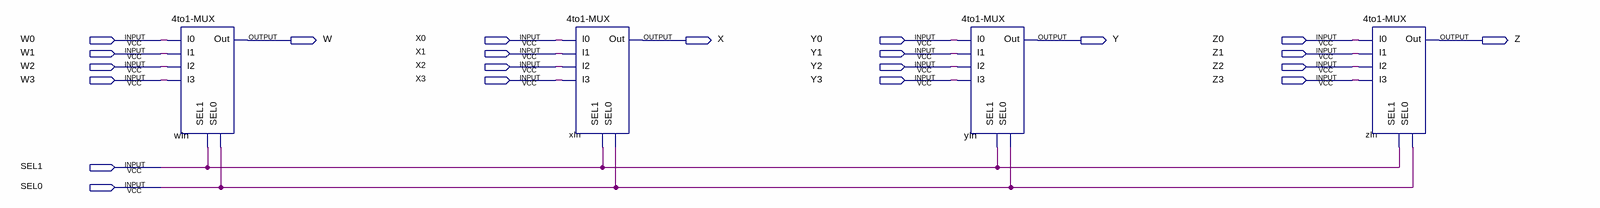
[diagram p0: schematic sheet]
// Quartus schematic QUAD4-1MUX.bdf as structural Verilog: 4 symbols, 22 pins
module \QUAD4-1MUX  (
  input  W0,
  input  X0,
  input  Y0,
  input  Z0,
  input  W1,
  input  X1,
  input  Y1,
  input  Z1,
  input  W2,
  input  X2,
  input  Y2,
  input  Z2,
  input  W3,
  input  X3,
  input  Y3,
  input  Z3,
  input  SEL1,
  input  SEL0,
  output W,
  output X,
  output Y,
  output Z
);

  \4to1-MUX  wIn (.SEL1(SEL1), .SEL0(SEL0), .I0(W0), .I1(W1), .I2(W2), .I3(W3), .Out(W));
  \4to1-MUX  xIn (.SEL1(SEL1), .SEL0(SEL0), .I0(X0), .I1(X1), .I2(X2), .I3(X3), .Out(X));
  \4to1-MUX  yIn (.SEL1(SEL1), .SEL0(SEL0), .I0(Y0), .I1(Y1), .I2(Y2), .I3(Y3), .Out(Y));
  \4to1-MUX  zIn (.SEL1(SEL1), .SEL0(SEL0), .I0(Z0), .I1(Z1), .I2(Z2), .I3(Z3), .Out(Z));
endmodule
